# EAGLE schematic controller (EAGLE 6.5.0)
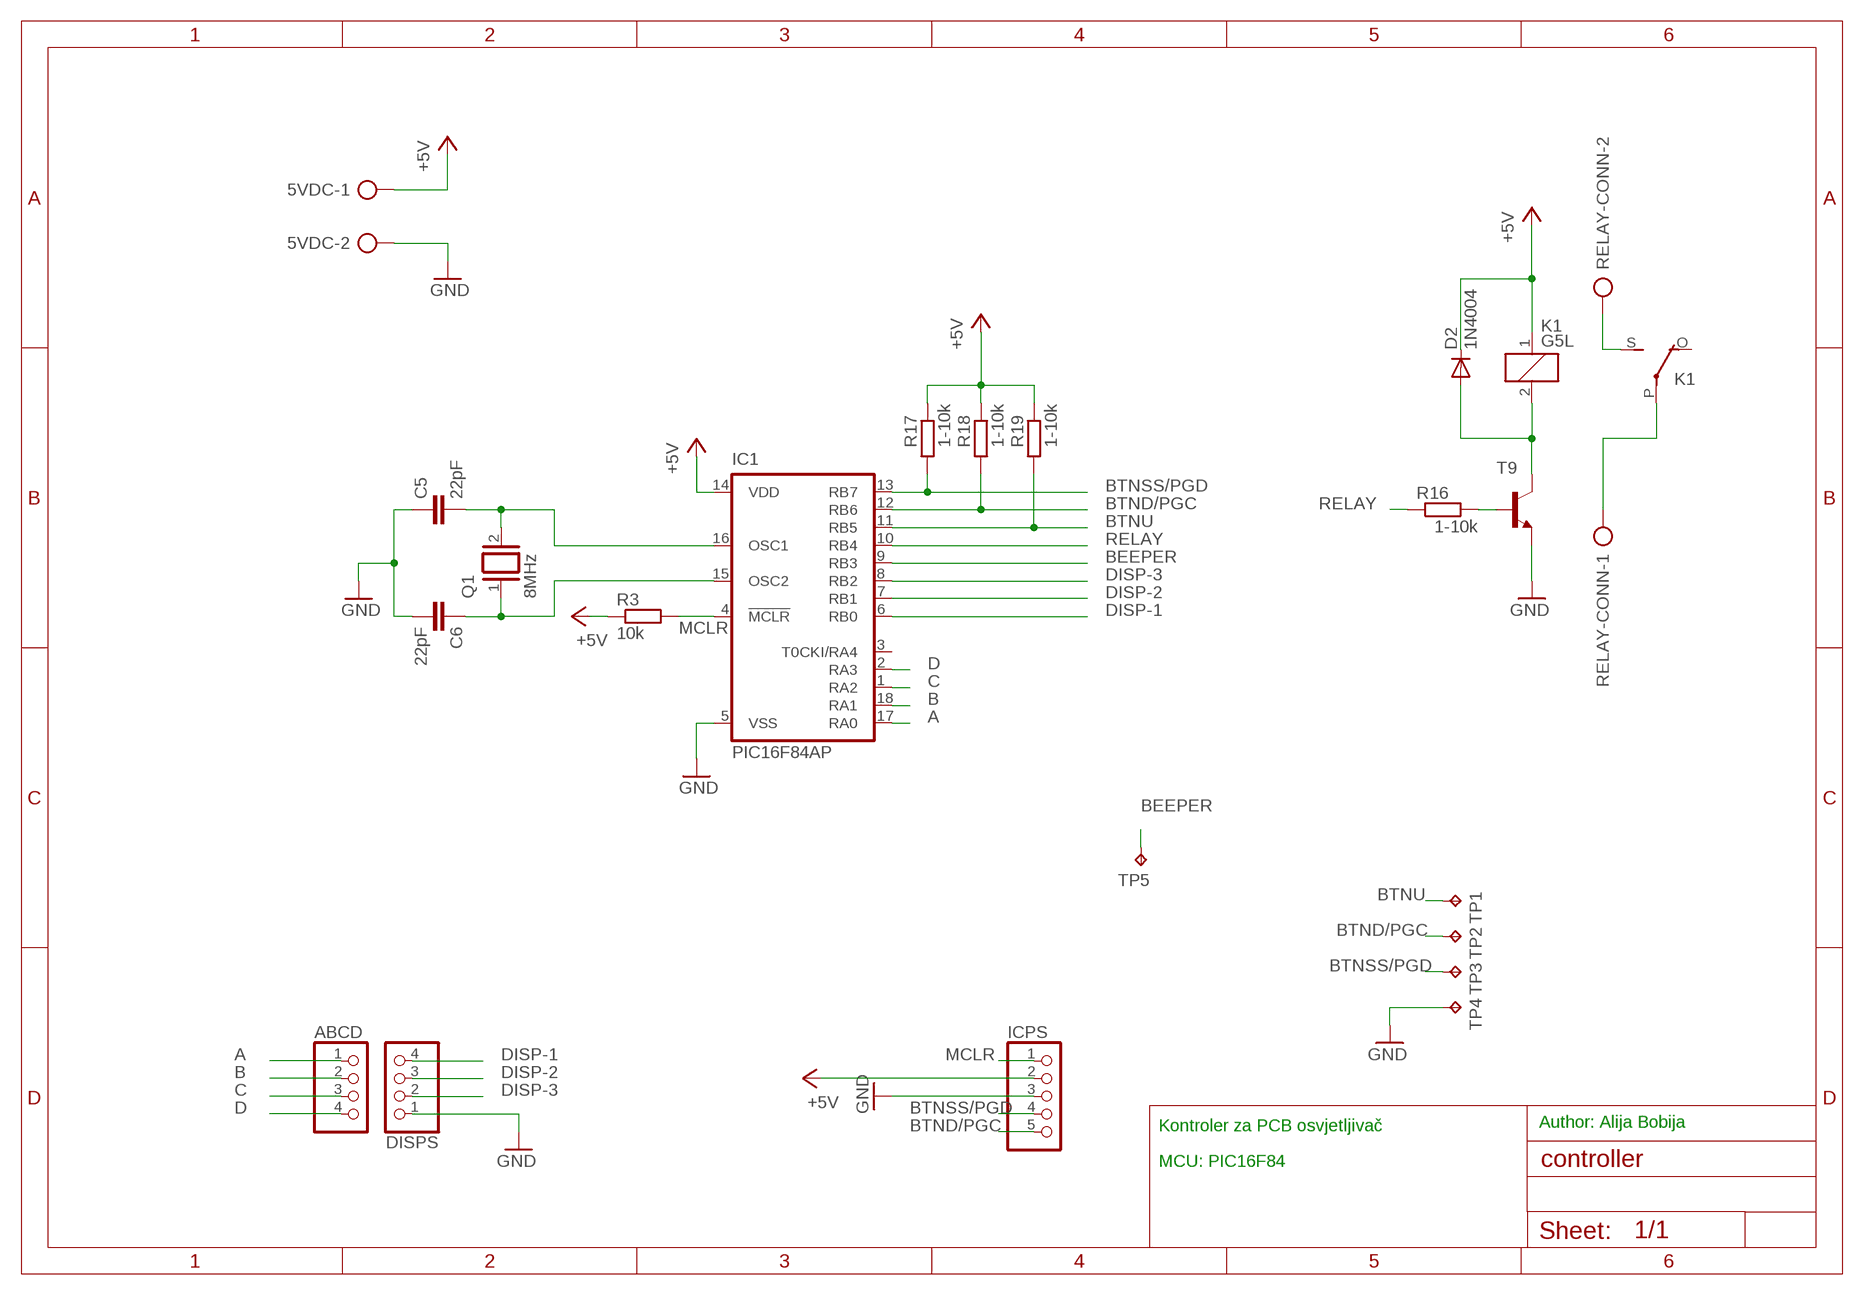
[diagram p0: schematic, sheet 1]

## Parts
5VDC  AK500/2  [AK500/2]
ABCD  PINHD-1X4  [1X04]
C5  22pF  C-EU025-024X044  [C025-024X044]
C6  22pF  C-EU025-024X044  [C025-024X044]
D2  1N4004  [DO41-10]
DISPS  PINHD-1X4  [1X04]
IC1  PIC16F84AP  [DIL18]
ICPS  PINHD-1X5/90  [1X05/90]
K1  G5L  [G5LE]
Q1  8MHz  XTAL/S  [QS]
R3  10k  R-EU_0207/7  [0207/7]
R16  1-10k  R-EU_0207/7  [0207/7]
R17  1-10k  R-EU_0207/7  [0207/7]
R18  1-10k  R-EU_0207/7  [0207/7]
R19  1-10k  R-EU_0207/7  [0207/7]
RELAY-CONN  AK500/2  [AK500/2]
T9  -NPN-SOT23-EBC  [SOT23-EBC]
TP1  TPTP15SQ  [TP15SQ]
TP2  TPTP15SQ  [TP15SQ]
TP3  TPTP15SQ  [TP15SQ]
TP4  TPTP15SQ  [TP15SQ]
TP5  TPTP15SQ  [TP15SQ]

## Nets
+5V: 5VDC.1 D2.C IC1.14(VDD) ICPS.2 K1.1 R3.1 R17.2 R18.2 R19.2
A: ABCD.1 IC1.17(RA0)
B: ABCD.2 IC1.18(RA1)
BEEPER: IC1.9(RB3) TP5.TP
BTND/PGC: IC1.12(RB6) ICPS.5 R18.1 TP2.TP
BTNSS/PGD: IC1.13(RB7) ICPS.4 R17.1 TP3.TP
BTNU: IC1.11(RB5) R19.1 TP1.TP
C: ABCD.3 IC1.1(RA2)
D: ABCD.4 IC1.2(RA3)
DISP-1: DISPS.4 IC1.6(RB0)
DISP-2: DISPS.3 IC1.7(RB1)
DISP-3: DISPS.2 IC1.8(RB2)
GND: 5VDC.2 C5.1 C6.2 DISPS.1 IC1.5(VSS) ICPS.3 T9.E TP4.TP
MCLR: IC1.4(!MCLR) ICPS.1 R3.2
N$4: C5.2 IC1.16(OSC1) Q1.2
N$6: C6.1 IC1.15(OSC2) Q1.1
N$30: K1.S(2:S) RELAY-CONN.2
N$31: D2.A K1.2 T9.C
N$32: R16.2 T9.B
N$33: K1.P(2:P) RELAY-CONN.1
RELAY: IC1.10(RB4) R16.1
Unconnected: IC1.3(T0CKI/RA4) K1.O(2:O)

## Notes on the sheet
- Kontroler za PCB osvjetljivač | Author: Alija Bobija
- MCU: PIC16F84

## Library data of the parts
5VDC RELAY-CONN = con-ptr500:AK500/2: CONNECTOR; OC_FARNELL: unknown; OC_NEWARK: unknown
ABCD DISPS = pinhead:PINHD-1X4: PIN HEADER
C5 C6 = resistor:C-EU: CAPACITOR, European symbol
D2 = diode:1N4004: DIODE general purpose rectifier, 1 A
IC1 = microchip:PIC16F8*: MICROCONTROLLER 8-Bit PIC16F8X Family - CMOS Flash/EEPROM Pin Compatible : PIC16F83, PIC16CR83, PIC16F84A, PIC16CR84 see also PIC16C* <DEVICE:PIC16C*>; MF: MICROCHIP; MPN: PIC16F84A-04I/P; OC_FARNELL: 9760865; OC_NEWARK: 69K7635
ICPS = pinhead:PINHD-1X5: PIN HEADER
K1 = relay:G5L: RELAY 1 x switch, 10 A/120 V AC, 8 A/30 V ADC, Omron; OC_FARNELL: unknown; OC_NEWARK: unknown
Q1 = special:XTAL/S: CRYSTAL
R3 R16-R19 = resistor:R-EU_: RESISTOR, European symbol
T9 = transistor:*-NPN-: NPN Transistror BF959 corrected 2008.03.06
TP1-TP5 = testpad:TP: Test pad